# EAGLE design candle- (EAGLE 6.6.0)
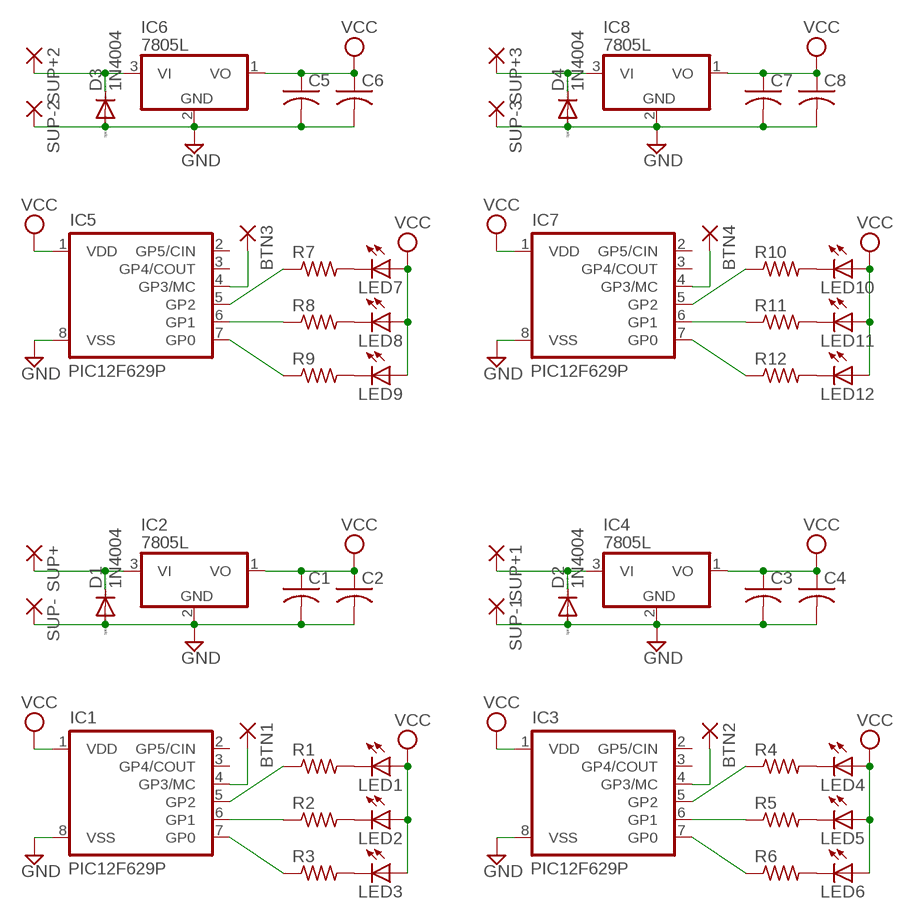
[diagram p0: schematic, sheet 1]

## Parts
BTN1  1,6/0,8  [1,6/0,8]
BTN2  1,6/0,8  [1,6/0,8]
BTN3  1,6/0,8  [1,6/0,8]
BTN4  1,6/0,8  [1,6/0,8]
C1  C-US025-025X050  [C025-025X050]
C2  C-US025-025X050  [C025-025X050]
C3  C-US025-025X050  [C025-025X050]
C4  C-US025-025X050  [C025-025X050]
C5  C-US025-025X050  [C025-025X050]
C6  C-US025-025X050  [C025-025X050]
C7  C-US025-025X050  [C025-025X050]
C8  C-US025-025X050  [C025-025X050]
D1  1N4004  [DO41-10]
D2  1N4004  [DO41-10]
D3  1N4004  [DO41-10]
D4  1N4004  [DO41-10]
IC1  PIC12F629P  PIC12C671P  [DIL8]
IC2  7805L  [TO92]
IC3  PIC12F629P  PIC12C671P  [DIL8]
IC4  7805L  [TO92]
IC5  PIC12F629P  PIC12C671P  [DIL8]
IC6  7805L  [TO92]
IC7  PIC12F629P  PIC12C671P  [DIL8]
IC8  7805L  [TO92]
LED1  LED5MM  [LED5MM]
LED2  LED5MM  [LED5MM]
LED3  LED5MM  [LED5MM]
LED4  LED5MM  [LED5MM]
LED5  LED5MM  [LED5MM]
LED6  LED5MM  [LED5MM]
LED7  LED5MM  [LED5MM]
LED8  LED5MM  [LED5MM]
LED9  LED5MM  [LED5MM]
LED10  LED5MM  [LED5MM]
LED11  LED5MM  [LED5MM]
LED12  LED5MM  [LED5MM]
R1  R-US_0204/7  [0204/7]
R2  R-US_0204/7  [0204/7]
R3  R-US_0204/7  [0204/7]
R4  R-US_0204/7  [0204/7]
R5  R-US_0204/7  [0204/7]
R6  R-US_0204/7  [0204/7]
R7  R-US_0204/7  [0204/7]
R8  R-US_0204/7  [0204/7]
R9  R-US_0204/7  [0204/7]
R10  R-US_0204/7  [0204/7]
R11  R-US_0204/7  [0204/7]
R12  R-US_0204/7  [0204/7]
SUP+  1,6/0,8  [1,6/0,8]
SUP+1  1,6/0,8  [1,6/0,8]
SUP+2  1,6/0,8  [1,6/0,8]
SUP+3  1,6/0,8  [1,6/0,8]
SUP-  1,6/0,8  [1,6/0,8]
SUP-1  1,6/0,8  [1,6/0,8]
SUP-2  1,6/0,8  [1,6/0,8]
SUP-3  1,6/0,8  [1,6/0,8]

## Nets
GND: C1.2 C2.2 C3.2 C4.2 C5.2 C6.2 C7.2 C8.2 D1.A D2.A D3.A D4.A IC1.8(VSS) IC2.2(GND) IC3.8(VSS) IC4.2(GND) IC5.8(VSS) IC6.2(GND) IC7.8(VSS) IC8.2(GND) SUP-1.1(P) SUP-2.1(P) SUP-3.1(P) SUP-.1(P)
N$1: IC3.7(GP0) R6.1
N$2: BTN1.1(P) IC1.4(GP3/MC)
N$3: IC1.7(GP0) R3.1
N$4: IC1.6(GP1) R2.1
N$5: IC1.5(GP2) R1.1
N$6: LED1.K(C) R1.2
N$7: LED2.K(C) R2.2
N$8: LED3.K(C) R3.2
N$9: IC3.6(GP1) R5.1
N$10: D1.C IC2.3(VI) SUP+.1(P)
N$11: IC3.5(GP2) R4.1
N$12: LED4.K(C) R4.2
N$13: LED5.K(C) R5.2
N$14: LED6.K(C) R6.2
N$15: D2.C IC4.3(VI) SUP+1.1(P)
N$16: BTN2.1(P) IC3.4(GP3/MC)
N$17: IC5.7(GP0) R9.1
N$18: IC5.6(GP1) R8.1
N$19: IC5.5(GP2) R7.1
N$20: LED7.K(C) R7.2
N$21: LED8.K(C) R8.2
N$22: LED9.K(C) R9.2
N$23: D3.C IC6.3(VI) SUP+2.1(P)
N$24: BTN3.1(P) IC5.4(GP3/MC)
N$25: IC7.7(GP0) R12.1
N$26: IC7.6(GP1) R11.1
N$27: IC7.5(GP2) R10.1
N$28: LED10.K(C) R10.2
N$29: LED11.K(C) R11.2
N$30: LED12.K(C) R12.2
N$31: D4.C IC8.3(VI) SUP+3.1(P)
N$32: BTN4.1(P) IC7.4(GP3/MC)
VCC: C1.1 C2.1 C3.1 C4.1 C5.1 C6.1 C7.1 C8.1 IC1.1(VDD) IC2.1(VO) IC3.1(VDD) IC4.1(VO) IC5.1(VDD) IC6.1(VO) IC7.1(VDD) IC8.1(VO) LED1.A LED2.A LED3.A LED4.A LED5.A LED6.A LED7.A LED8.A LED9.A LED10.A LED11.A LED12.A
Unconnected: IC1.2(GP5/CIN) IC1.3(GP4/COUT) IC3.2(GP5/CIN) IC3.3(GP4/COUT) IC5.2(GP5/CIN) IC5.3(GP4/COUT) IC7.2(GP5/CIN) IC7.3(GP4/COUT)

## Library data of the parts
BTN1-BTN4 SUP+ SUP+1-SUP+3 SUP- SUP-1-SUP-3 = wirepad:1,6/0,8: THROUGH-HOLE PAD
C1-C8 = rcl:C-US: CAPACITOR, American symbol
D1-D4 = diode:1N4004: DIODE general purpose rectifier, 1 A
IC1 IC3 IC5 IC7 = microchip:PIC12C*?: MICROCONTROLLER; MF: MICROCHIP; MPN: PIC12C671-10/P; OC_FARNELL: 9758860; OC_NEWARK: 23C2974
IC2 IC4 IC6 IC8 = linear:78*: Positive VOLTAGE REGULATOR Source: http://cache.national.com/ds/LM/LM78L05.pdf http://www.fairchildsemi.com/ds/LM/LM7805.pdf
LED1-LED12 = led:LED: LED OSRAM: - CHIPLED LG R971, LG N971, LY N971, LG Q971, LY Q971, LO R971, LY R971 LH N974, LH R974 LS Q976, LO Q976, LY Q976 LO Q996 - Hyper CHIPLED LW Q18S LB Q993, LB Q99A, LB R99A - SideLED LS A670, LO A670, LY A670, LG A670, LP A670 LB A673, LV A673, LT A673, LW A673 LH A674 LY A675 LS A676, LA A676, LO A676, LY A676, LW A676 LS A679, LY A679, LG A679 - Hyper Micro SIDELED® LS Y876, LA Y876, LO Y876, LY Y876 LT Y87S - SmartLED LW L88C, LW L88S LB L89C, LB L89S, LG L890 LS L89K, LO L89K, LY L89K LS L896, LA L896, LO L896, LY L896 - TOPLED LS T670, LO T670, LY T670, LG T670, LP T670 LSG T670, LSP T670, LSY T670, LOP T670, LYG T670 LG T671, LOG T671, LSG T671 LB T673, LV T673, LT T673, LW T673 LH T674 LS T676, LA T676, LO T676, LY T676, LB T676, LH T676, LSB T676, LW T676 LB T67C, LV T67C, LT T67C, LS T67K, LO T67K, LY T67K, LW E67C LS E67B, LA E67B, LO E67B, LY E67B, LB E67C, LV E67C, LT E67C LW T67C LS T679, LY T679, LG T679 LS T770, LO T770, LY T770, LG T770, LP T770 LB T773, LV T773, LT T773, LW T773 LH T774 LS E675, LA E675, LY E675, LS T675 LS T776, LA T776, LO T776, LY T776, LB T776 LHGB T686 LT T68C, LB T68C - Hyper Mini TOPLED® LB M676 - Mini TOPLED Santana® LG M470 LS M47K, LO M47K, LY M47K Source: http://www.osram.convergy.de LUXEON: - LUMILED® LXK2-PW12-R00, LXK2-PW12-S00, LXK2-PW14-U00, LXK2-PW14-V00 LXK2-PM12-R00, LXK2-PM12-S00, LXK2-PM14-U00 LXK2-PE12-Q00, LXK2-PE12-R00, LXK2-PE12-S00, LXK2-PE14-T00, LXK2-PE14-U00 LXK2-PB12-K00, LXK2-PB12-L00, LXK2-PB12-M00, LXK2-PB14-N00, LXK2-PB14-P00, LXK2-PB14-Q00 LXK2-PR12-L00, LXK2-PR12-M00, LXK2-PR14-Q00, LXK2-PR14-R00 LXK2-PD12-Q00, LXK2-PD12-R00, LXK2-PD12-S00 LXK2-PH12-R00, LXK2-PH12-S00 LXK2-PL12-P00, LXK2-PL12-Q00, LXK2-PL12-R00 Source: www.luxeon.com KINGBRIGHT: KA-3528ASYC Source: www.kingbright.com
R1-R12 = rcl:R-US_: RESISTOR, American symbol

## Board
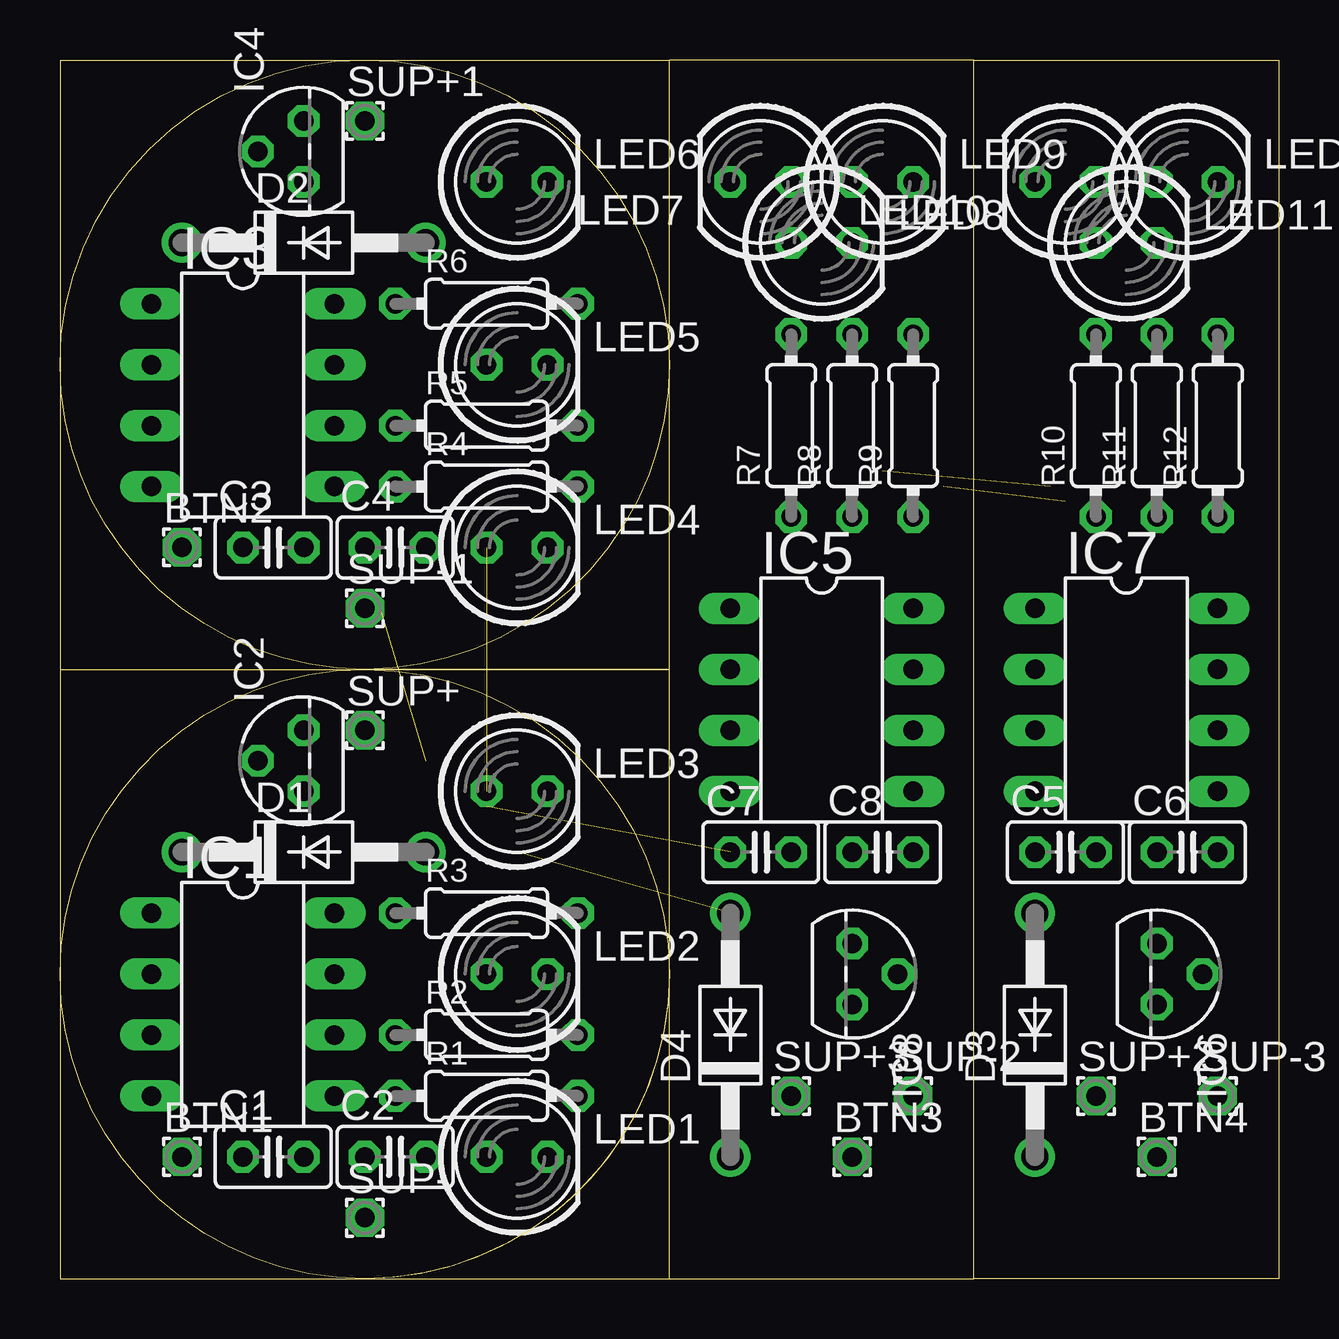
[diagram p1: board, top side]
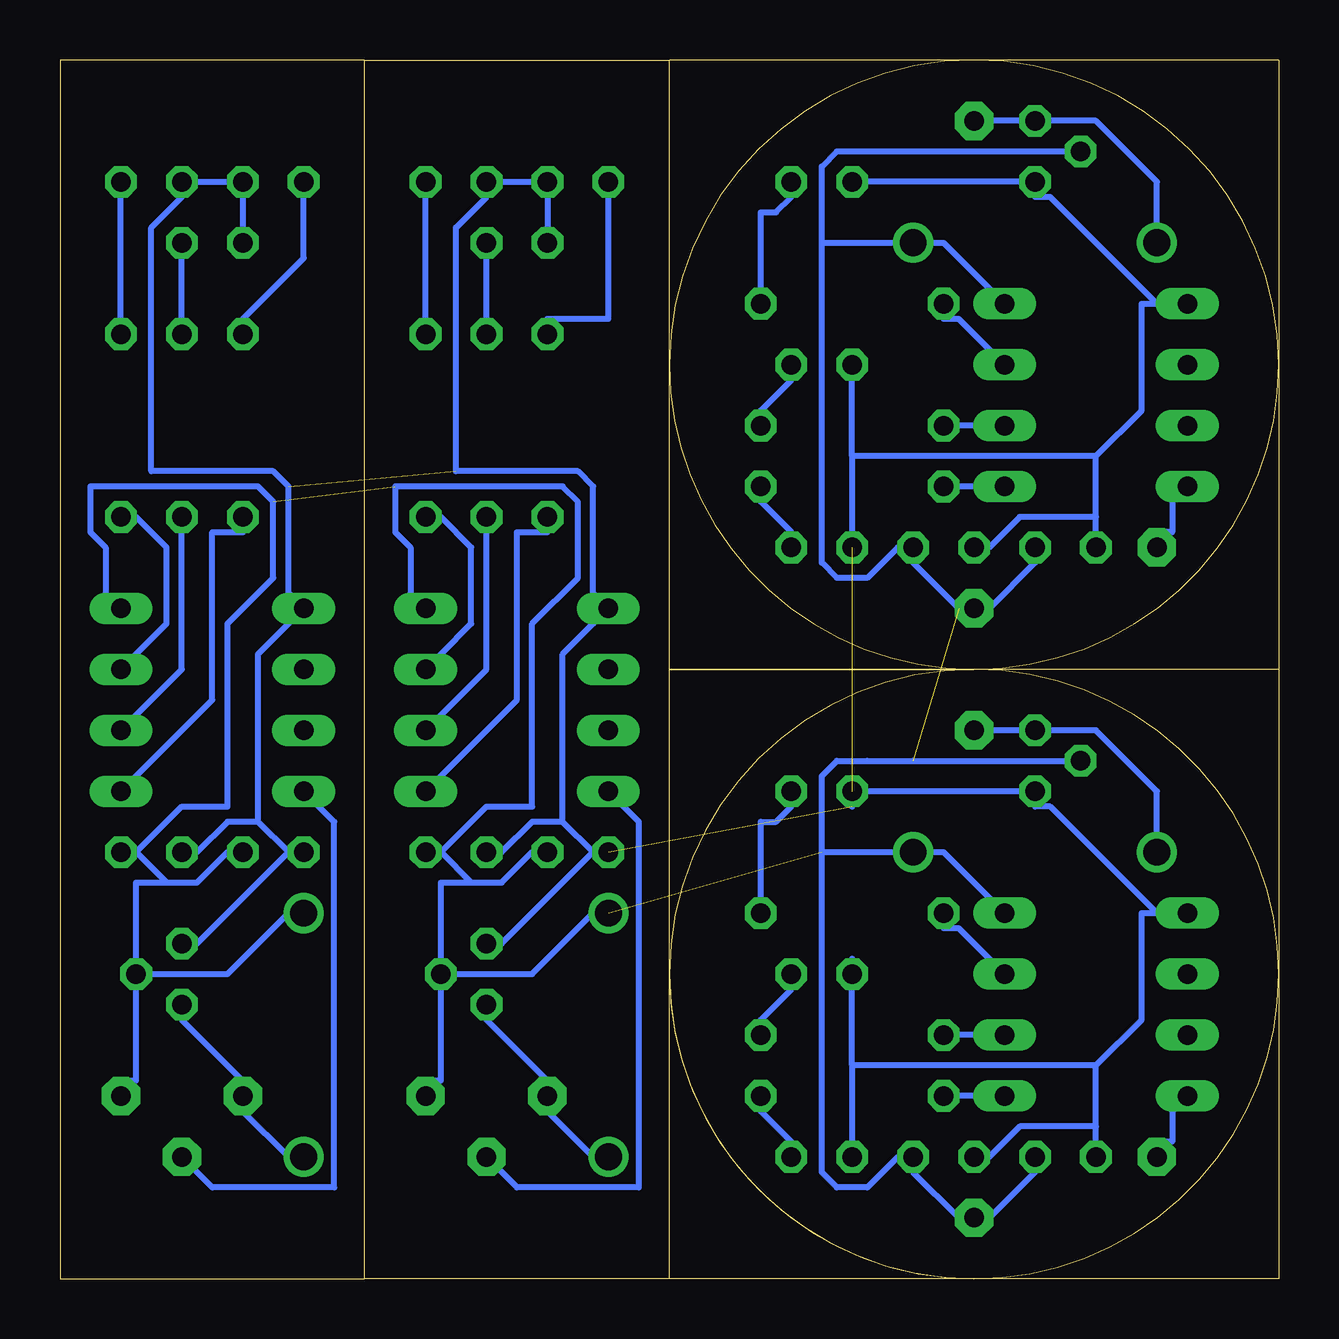
[diagram p2: board, bottom side, seen from below]

Size 50.8 x 50.8 mm. Coordinates in mm from the lower left corner, seen from the top.
Outline: 25.4,0 25.4,25.4
Outline: 25.4,25.4 12.7,25.4
Outline: 25.4,12.7 arc-90 12.7,0
Outline: 12.7,0 arc-90 0,12.7
Outline: 0,25.4 0,12.7
Outline: 0,12.7 0,0 12.7,0
Outline: 0,25.4 12.7,25.4
Outline: 12.7,25.4 25.4,25.4
Outline: 12.7,0 25.4,0
Outline: 0,12.7 arc-90 12.7,25.4
Outline: 12.7,25.4 arc-180 12.7,0
Outline: 0,38.1 0,25.4
Outline: 0,38.1 0,50.8 25.4,50.8
Outline: 25.4,25.4 25.4,38.1
Outline: 25.4,38.1 25.4,50.8
Outline: 0,38.1 arc-180 25.4,38.1
Outline: 25.4,38.1 arc-90 12.7,25.4
Outline: 12.7,25.4 arc-90 0,38.1
Outline: 25.4,0 38.1,0
Outline: 38.1,0 38.1,50.8
Outline: 38.1,50.8 25.4,50.8
Outline: 38.1,50.8 50.8,50.8 50.8,0 38.1,0
Copper layers (1*16): Top 0.035mm / dielectric 1.5mm / Bottom 0.035mm
Design rules "10mils": minimum track width 10mil, minimum drill 24mil, track to track 10mil, track to pad 10mil, pad to pad 10mil, via to via 10mil, smd to smd 10mil, copper to edge 40mil, drill to drill 10mil, minimum pad ring 10mil, minimum via ring 8mil, stop-mask expansion 0mil, vias tented up to drill 0mil, thermal gap 10mil

### Footprints (pad centres in the part's own frame; a part is rotated, then mirrored left to right if it is on the bottom)
1,6/0,8 = drill 0.813 pad 1.6 octagon: 1 0,0
C025-025X050 = drill 0.813 octagon: 1 -1.27,0; 2 1.27,0
DO41-10 = drill 1.118: A 5.08,0; C -5.08,0
DIL8 = drill 0.813 long: 1 -3.81,-3.81; 2 -1.27,-3.81; 3 1.27,-3.81; 4 3.81,-3.81; 5 3.81,3.81; 6 1.27,3.81; 7 -1.27,3.81; 8 -3.81,3.81
TO92 = drill 0.813 octagon: 1 -1.27,0; 2 0,1.905; 3 1.27,0
LED5MM = drill 0.813 octagon: A -1.27,0; K 1.27,0
0204/7 = drill 0.813 octagon: 1 -3.81,0; 2 3.81,0

### Placement (x,y rotation side)
BTN1  5.08,5.08 0 top
BTN2  5.08,30.48 0 top
BTN3  33.02,5.08 0 top
BTN4  45.72,5.08 0 top
C1  8.89,5.08 0 top
C2  13.97,5.08 0 top
C3  8.89,30.48 0 top
C4  13.97,30.48 0 top
C5  41.91,17.78 0 top
C6  46.99,17.78 0 top
C7  29.21,17.78 0 top
C8  34.29,17.78 0 top
D1  10.16,17.78 0 top
D2  10.16,43.18 0 top
D3  40.64,10.16 90 top
D4  27.94,10.16 90 top
IC1  7.62,11.43 270 top
IC2  10.16,21.59 90 top
IC3  7.62,36.83 270 top
IC4  10.16,46.99 90 top
IC5  31.75,24.13 270 top
IC6  45.72,12.7 270 top
IC7  44.45,24.13 270 top
IC8  33.02,12.7 270 top
LED1  19.05,5.08 0 top
LED2  19.05,12.7 0 top
LED3  19.05,20.32 0 top
LED4  19.05,30.48 0 top
LED5  19.05,38.1 0 top
LED6  19.05,45.72 0 top
LED7  29.21,45.72 180 top
LED8  31.75,43.18 0 top
LED9  34.29,45.72 0 top
LED10  41.91,45.72 180 top
LED11  44.45,43.18 0 top
LED12  46.99,45.72 0 top
R1  17.78,7.62 0 top
R2  17.78,10.16 0 top
R3  17.78,15.24 0 top
R4  17.78,33.02 0 top
R5  17.78,35.56 0 top
R6  17.78,40.64 0 top
R7  30.48,35.56 90 top
R8  33.02,35.56 90 top
R9  35.56,35.56 90 top
R10  43.18,35.56 90 top
R11  45.72,35.56 90 top
R12  48.26,35.56 90 top
SUP+  12.7,22.86 0 top
SUP+1  12.7,48.26 0 top
SUP+2  43.18,7.62 0 top
SUP+3  30.48,7.62 0 top
SUP-  12.7,2.54 0 top
SUP-1  12.7,27.94 0 top
SUP-2  35.56,7.62 0 top
SUP-3  48.26,7.62 0 top

### Tracks (layer width: path | path; a pad name or v marks a point on that pad's centre or on a via)
GND  (3 unrouted)
  Bottom 0.254: IC6.2 47.62,12.06 47.62,8.26 48.26,8.26 SUP-3.1 | 46.35,16.51 45.09,16.51 43.81,17.78 C5.2 | 46.35,16.51 47.62,17.78 | 47.62,17.78 C6.2 47.62,17.78 | 47.62,17.78 45.72,19.68 43.81,19.68 43.81,27.3 41.91,29.21 41.91,32.38 42.55,33.02 49.53,33.02 49.53,31.11 48.9,30.48 48.9,28.57 IC7.8 | 46.35,16.51 47.62,16.51 47.62,13.34 IC6.2 | IC8.2 34.92,12.06 34.92,8.26 35.56,8.26 SUP-2.1 | 33.66,16.51 32.38,16.51 31.11,17.78 C7.2 | 33.66,16.51 34.92,17.78 | 34.92,17.78 C8.2 34.92,17.78 | 34.92,17.78 33.02,19.68 31.11,19.68 31.11,27.3 29.21,29.21 29.21,32.38 29.84,33.02 36.83,33.02 36.83,31.11 36.2,30.48 36.2,28.57 IC5.8 | 33.66,16.51 34.92,16.51 34.92,13.34 IC8.2 | D4.A 28.57,15.24 31.11,12.7 34.29,12.7 IC8.2 | D3.A 41.27,15.24 43.81,12.7 46.99,12.7 IC6.2 | C1.2 10.16,4.45 12.06,2.54 SUP-.1 13.34,2.54 15.24,4.45 C2.2 15.88,5.08 17.14,3.81 18.41,3.81 19.05,4.45 19.05,17.78 | IC2.2 8.89,21.59 15.24,21.59 17.14,21.59 18.41,21.59 19.05,20.95 19.05,17.78 | IC4.2 8.89,46.99 18.41,46.99 19.05,46.35 19.05,43.81 19.05,43.18 | IC3.8 12.06,41.27 13.97,43.18 14.61,43.18 D2.A 15.88,43.18 19.05,43.18 | 19.05,43.18 19.05,29.84 18.41,29.21 17.14,29.21 15.88,30.48 C4.2 15.24,29.84 13.34,27.94 SUP-1.1 12.06,27.94 10.16,29.84 C3.2 | IC1.8 12.06,15.88 13.97,17.78 14.61,17.78 D1.A | D1.A 15.24,18.41 | 19.05,17.78 15.88,17.78 D1.A
N$1
  Bottom 0.254: IC3.7 12.06,38.73 13.34,40.01 13.97,40.01 R6.1
N$2
  Bottom 0.254: IC1.4 4.45,6.99 4.45,5.71 5.08,5.71 BTN1.1
N$3
  Bottom 0.254: IC1.7 12.06,13.34 13.34,14.61 13.97,14.61 R3.1
N$4
  Bottom 0.254: IC1.6 12.7,10.16 13.34,10.16 R2.1
N$5
  Bottom 0.254: IC1.5 12.7,7.62 13.34,7.62 R1.1
N$6
  Bottom 0.254: LED1.K 20.32,5.71 21.59,6.99 R1.2
N$7
  Bottom 0.254: R2.2 21.59,10.79 20.32,12.06 LED2.K
N$8
  Bottom 0.254: R3.2 21.59,15.88 21.59,19.05 20.95,19.05 20.32,19.68 LED3.K
N$9
  Bottom 0.254: IC3.6 12.7,35.56 13.34,35.56 R5.1
N$10
  Bottom 0.254: SUP+.1 12.06,22.86 10.79,22.86 IC2.3 7.62,22.86 5.08,20.32 | 5.08,20.32 D1.C 5.08,20.32
N$11
  Bottom 0.254: IC3.5 12.7,33.02 13.34,33.02 R4.1
N$12
  Bottom 0.254: LED4.K 20.32,31.11 21.59,32.38 R4.2
N$13
  Bottom 0.254: R5.2 21.59,36.2 20.32,37.47 LED5.K
N$14
  Bottom 0.254: R6.2 21.59,41.27 21.59,44.45 20.95,44.45 20.32,45.09 LED6.K
N$15
  Bottom 0.254: SUP+1.1 10.79,48.26 IC4.3 7.62,48.26 5.08,45.72 D2.C
N$16
  Bottom 0.254: IC3.4 4.45,32.38 4.45,31.11 5.08,31.11 BTN2.1
N$17
  Bottom 0.254: IC5.7 34.92,26.04 33.66,27.3 33.66,30.48 34.92,31.75 R9.1
N$18
  Bottom 0.254: IC5.6 34.92,23.5 33.02,25.4 33.02,31.11 R8.1
N$19
  Bottom 0.254: IC5.5 34.92,20.95 31.75,24.13 31.75,31.11 30.48,31.11 R7.1
N$20
  Bottom 0.254: 30.48,40.01 R7.2 30.48,40.01 | 30.48,40.01 27.94,40.01 27.94,45.09 LED7.K
N$21
  Bottom 0.254: R8.2 33.02,40.01 33.02,42.55 LED8.K
N$22
  Bottom 0.254: R9.2 35.56,40.01 35.56,45.09 LED9.K
N$23
  Bottom 0.254: IC6.3 45.72,10.79 43.18,8.26 SUP+2.1 43.18,6.99 41.27,5.08 D3.C
N$24
  Bottom 0.254: BTN3.1 31.75,3.81 26.67,3.81 26.67,17.78 26.67,19.05 IC5.4
N$25
  Bottom 0.254: IC7.7 47.62,26.04 46.35,27.3 46.35,30.48 47.62,31.75 R12.1
N$26
  Bottom 0.254: IC7.6 47.62,23.5 45.72,25.4 45.72,31.11 R11.1
N$27
  Bottom 0.254: IC7.5 47.62,20.95 44.45,24.13 44.45,31.11 43.18,31.11 R10.1
N$28
  Bottom 0.254: R10.2 43.18,40.01 40.64,42.55 40.64,45.09 LED10.K
N$29
  Bottom 0.254: R11.2 45.72,40.01 45.72,42.55 LED11.K
N$30
  Bottom 0.254: R12.2 48.26,40.01 48.26,45.09 LED12.K
N$31
  Bottom 0.254: IC8.3 33.02,10.79 30.48,8.26 SUP+3.1 30.48,6.99 28.57,5.08 D4.C
N$32
  Bottom 0.254: IC7.4 39.37,19.05 39.37,3.81 44.45,3.81 BTN4.1
VCC  (3 unrouted)
  Bottom 0.254: 32.38,13.97 IC8.1 32.38,13.97 | 28.57,17.78 C7.1 | 29.84,19.05 31.11,19.05 32.38,17.78 C8.1 | 28.57,17.78 29.84,19.05 | 28.57,17.78 C7.1 | 29.84,19.05 29.84,26.04 28.57,27.3 IC5.1 28.57,28.57 28.57,33.02 29.21,33.66 34.29,33.66 34.29,43.81 33.02,45.09 LED9.A 32.38,45.72 31.11,45.72 LED7.A 30.48,45.09 30.48,43.81 LED8.A | 41.27,17.78 45.09,13.97 IC6.1 | 41.27,17.78 C5.1 41.27,17.78 | 42.55,19.05 43.81,19.05 45.09,17.78 C6.1 | 41.27,17.78 42.55,19.05 | 42.55,19.05 42.55,26.04 41.27,27.3 IC7.1 41.27,28.57 41.27,33.02 41.91,33.66 46.99,33.66 46.99,43.81 45.72,45.09 LED12.A 45.09,45.72 43.81,45.72 LED10.A 43.18,45.09 43.18,43.81 LED11.A | 32.38,13.97 28.57,17.78 | 28.57,17.78 C7.1 | 17.78,8.89 17.78,6.35 17.78,5.71 LED1.A | 17.78,8.89 17.78,12.06 LED2.A 17.78,13.34 | 5.08,15.24 9.53,19.68 10.16,19.68 IC2.1 10.79,20.32 17.14,20.32 LED3.A 17.78,19.68 | 5.08,15.24 IC1.1 5.08,15.24 | 7.62,6.35 7.62,5.71 C1.1 | 7.62,6.35 7.62,8.89 | 17.78,34.29 17.78,31.75 17.78,31.11 LED4.A | 17.78,34.29 17.78,37.47 LED5.A | 5.08,40.64 9.53,45.09 10.16,45.09 IC4.1 10.79,45.72 17.14,45.72 LED6.A | 5.08,40.64 IC3.1 5.08,40.64 | 7.62,31.75 7.62,31.11 C3.1 | 7.62,31.75 7.62,34.29 | 7.62,6.35 10.79,6.35 12.06,5.08 C2.1 | 7.62,8.89 17.78,8.89 | 7.62,31.75 10.79,31.75 12.06,30.48 C4.1 | 7.62,34.29 17.78,34.29 | 7.62,34.29 5.71,36.2 5.71,40.64 5.08,40.64 | 7.62,8.89 5.71,10.79 5.71,15.24 5.08,15.24